# EAGLE design PCB (EAGLE 9.6.2)
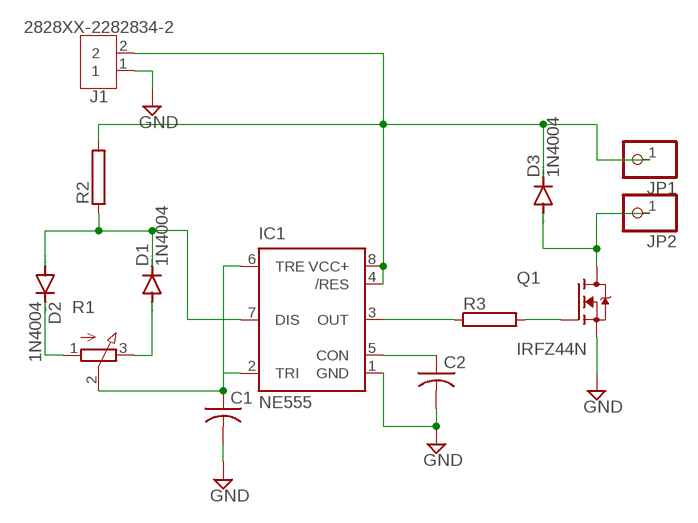
[diagram p0: schematic, sheet 1]

## Parts
C1  C-US025-024X044  [C025-024X044]
C2  C-US025-024X044  [C025-024X044]
D1  1N4004  [DO41-10]
D2  1N4004  [DO41-10]
D3  1N4004  [DO41-10]
IC1  NE555  [DIL-08]
J1  2828XX-2282834-2  [TERMBLK_254-2N]
JP1  PINHD-1X1  [1X01]
JP2  PINHD-1X1  [1X01]
Q1  IRFZ44N  [TO254P1016X419X2286-3]
R1  3RP/1610N  [3RP/1610N]
R2  RAC01  [AC01]
R3  RAC01  [AC01]

## Nets
GND: C1.2 C2.2 IC1.1(GND) J1.1 Q1.3(S)
N$1: D3.A JP2.1 Q1.2(D)
N$2: Q1.1(G) R3.2
N$3: IC1.3(OUT) R3.1
N$4: C2.1 IC1.5(CON)
N$5: D1.A R1.3(E)
N$6: D2.C R1.1(A)
N$7: C1.1 IC1.2(TRI) IC1.6(TRE) R1.2(S)
N$8: D1.C D2.A IC1.7(DIS) R2.1
N$9: D3.C IC1.4(/RES) IC1.8(VCC+) J1.2 JP1.1 R2.2

## Library data of the parts
C1 C2 = rcl:C-US: CAPACITOR, American symbol; SPICEPREFIX: C
D1-D3 = diode:1N4004: DIODE general purpose rectifier, 1 A
IC1 = st-microelectronics:NE555: General purpose bipolar Timer; MF: Arrow Electronics; MPN: NE555N; OC_FARNELL: 1467742; OC_NEWARK: 89K1486
J1 = Connector:2828XX-2: 2 Position Wire to Board Terminal Block Horizontal with Board Datasheet <https://www.te.com.cn/commerce/DocumentDelivery/DDEController?Action=showdoc&DocId=Catalog+Section%7F1308389_EUROSTYLE_TERMINAL_BLOCKS%7F0607%7Fpdf%7FEnglish%7FENG_CS_1308389_EUROSTYLE_TERMINAL_BLOCKS_0607.pdf%7F2-282837-5>; CATEGORY: Fixed Terminal Blocks; DATASHEET: https://www.te.com/usa-en/product-282834-2.datasheet.pdf; DESCRIPTION: 2 Position Wire to Board Terminal Block Horizontal with Board 0.100" (2.54mm) Through Hole; MANUFACTURER: TE Connectivity AMP Connectors; MPN: 282834-2; OPERATING_TEMPERATURE: -40°C ~ 105°C; PACKAGE_SIZE: NA; PACKAGE_TYPE: THT; PART_STATUS: ACTIVE; PITCH: 0.100" (2.54mm); ROHS: COMPLIANT; SERIES: Buchanan; SUBCATEGORY: Terminal Blocks; TYPE: Through Hole Screw - Rising Cage Clamp Side wire entry Horizontal with Board
JP1 JP2 = pinhead:PINHD-1X1: PIN HEADER
Q1 = IRFZ44N:IRFZ44N: Check availability <https://pricing.snapeda.com/parts/IRFZ44N/Infineon%20Technologies/view-part?ref=eda>; AVAILABILITY: In Stock; CHECK_PRICES: https://www.snapeda.com/parts/IRFZ44N/Infineon+Technologies/view-part/?ref=eda; DESCRIPTION: N-Channel 55 V 49A (Tc) 94W (Tc) Through Hole TO-220AB; MF: Infineon Technologies; MP: IRFZ44N; PACKAGE: TO-220-3 Infineon; PRICE: None; SNAPEDA_LINK: https://www.snapeda.com/parts/IRFZ44N/Infineon+Technologies/view-part/?ref=snap
R1 = pot:3RP/1610N: 16mm Potentiometer one level Source: http://www.alphapotentiometers.net/html/16mm_pot_2.html
R2 R3 = resistor-power:R: Power Resitor; OC_FARNELL: unknown; OC_NEWARK: unknown

## Board
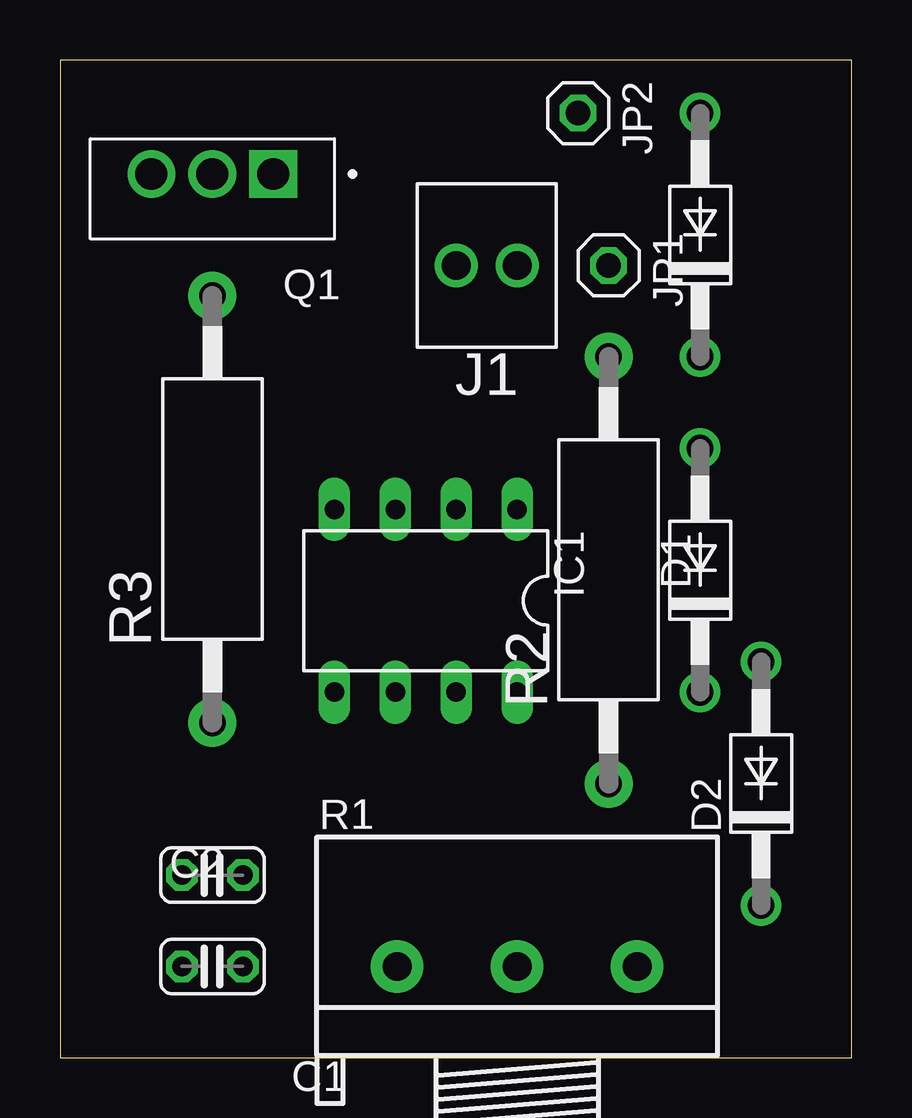
[diagram p1: board, top side]
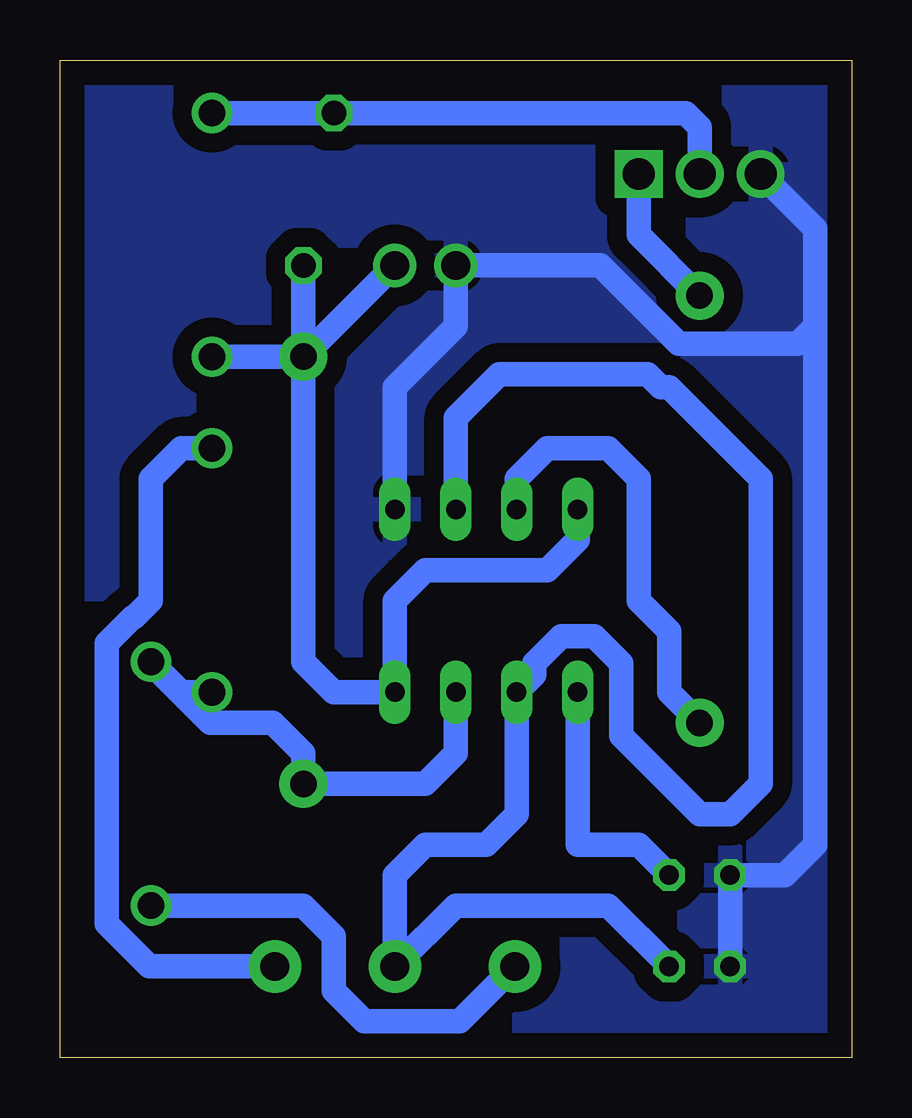
[diagram p2: board, bottom side, seen from below]

Size 33 x 41.58 mm. Coordinates in mm from the lower left corner, seen from the top.
Outline: 0,0 33,0 33,41.58 0,41.58 0,0
Copper layers (1*16): Top 0.035mm / dielectric 1.5mm / Bottom 0.035mm
Design rules "default *": minimum track width 6mil, minimum drill 0.6mm, track to track 0.8mm, track to pad 0.5mm, pad to pad 0.5mm, via to via 6mil, smd to smd 6mil, copper to edge 40mil, drill to drill 60mil, minimum pad ring 10mil, minimum via ring 8mil, stop-mask expansion 4mil, vias tented up to drill 0mil, thermal gap 10mil

### Footprints (pad centres in the part's own frame; a part is rotated, then mirrored left to right if it is on the bottom)
C025-024X044 = drill 0.813 octagon: 1 -1.27,0; 2 1.27,0
DO41-10 = drill 1.118: A 5.08,0; C -5.08,0
DIL-08 = drill 0.813 long: 1 -3.81,-3.81; 2 -1.27,-3.81; 3 1.27,-3.81; 4 3.81,-3.81; 5 3.81,3.81; 6 1.27,3.81; 7 -1.27,3.81; 8 -3.81,3.81
TERMBLK_254-2N = drill 1.2: 1 0,0; 2 2.54,0
1X01 = drill 1.016 octagon: 1 0,0
TO254P1016X419X2286-3 = drill 1.33 square: 1 -2.54,0 | drill 1.33: 2 0,0; 3 2.54,0
3RP/1610N = drill 1.2 pad 2.184: 1 -5,0; 2 0,0; 3 5,0
AC01 = drill 1.1 pad 2: 1 -8.9,0; 2 8.9,0

### Placement (x,y rotation side)
C1  6.35,3.81 180 top
C2  6.35,7.62 180 top
D1  26.67,20.32 90 top
D2  29.21,11.43 90 top
D3  26.67,34.29 90 top
IC1  15.24,19.05 180 top
J1  16.51,33.02 0 top
JP1  22.86,33.02 270 top
JP2  21.59,39.37 270 top
Q1  6.35,36.83 180 top
R1  19.05,3.81 0 top
R2  22.86,20.32 90 top
R3  6.35,22.86 90 top

### Tracks (layer width: path | path; a pad name or v marks a point on that pad's centre or on a via)
GND
  Bottom 1.016: C1.2 C2.2 2.79,7.62 1.52,8.89 1.52,30.48 | Q1.3 1.52,34.54 1.52,30.48 | IC1.1 19.05,27.94 16.51,30.48 J1.1 10.48,33.02 7.22,29.75 2.25,29.75 1.52,30.48
  pour Bottom: 0,41.91 33.02,41.91 33.02,0 0,0
N$1
  Bottom 1.016: Q1.2 6.35,38.79 6.93,39.37 JP2.1 D3.A
N$2
  Bottom 1.016: R3.2 8.89,34.29 Q1.1
N$3
  Bottom 1.016: R3.1 7.62,15.23 7.62,17.78 8.89,19.05 8.89,24.13 10.16,25.4 12.7,25.4 13.97,24.13 IC1.3
N$4
  Bottom 1.016: C2.1 8.89,8.89 11.43,8.89 IC1.5
N$5
  Bottom 1.016: R1.3 29.28,3.81 31.06,5.59 31.06,17.28 29.98,18.36 29.9,18.36 29.21,19.05 29.21,24.13 27.94,25.4 D1.A
N$6
  Bottom 1.016: R1.1 16.34,1.52 20.32,1.52 21.59,2.79 21.59,5.08 22.86,6.35 D2.C
N$7
  Bottom 1.016: C1.1 10.16,6.35 16.51,6.35 R1.2 19.05,7.62 17.78,8.89 15.24,8.89 13.97,10.16 IC1.6 13.25,15.96 13.25,16.44 12.12,17.57 10.74,17.57 9.61,16.44 9.61,13.42 6.35,10.16 5.08,10.16 3.81,11.43 3.81,24.13 7.62,27.94 7.97,27.94 8.52,28.49 14.69,28.49 16.51,26.67 IC1.2
N$8
  Bottom 1.016: IC1.7 16.51,12.7 17.79,11.42 R2.1 22.86,12.7 24.13,13.97 26.74,13.97 29.21,16.44 D2.A 27.94,15.24 D1.C
N$9
  Bottom 1.016: R2.2 JP1.1 | R2.2 D3.C | IC1.4 11.43,21.59 12.7,20.32 17.78,20.32 19.05,19.05 IC1.8 21.59,15.24 22.86,16.51 R2.2 | R2.2 J1.2